# EasyEDA Pro project easyeda.eprj, board Dev_bl808
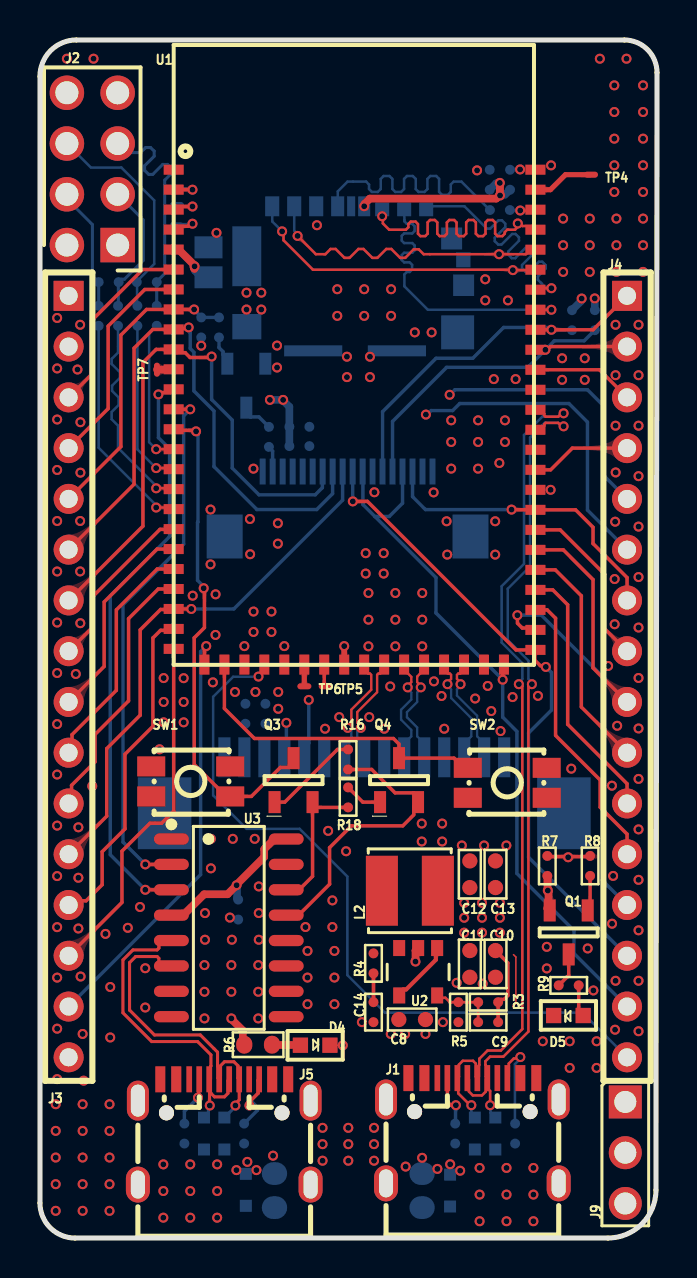
[diagram p2: board, top side]
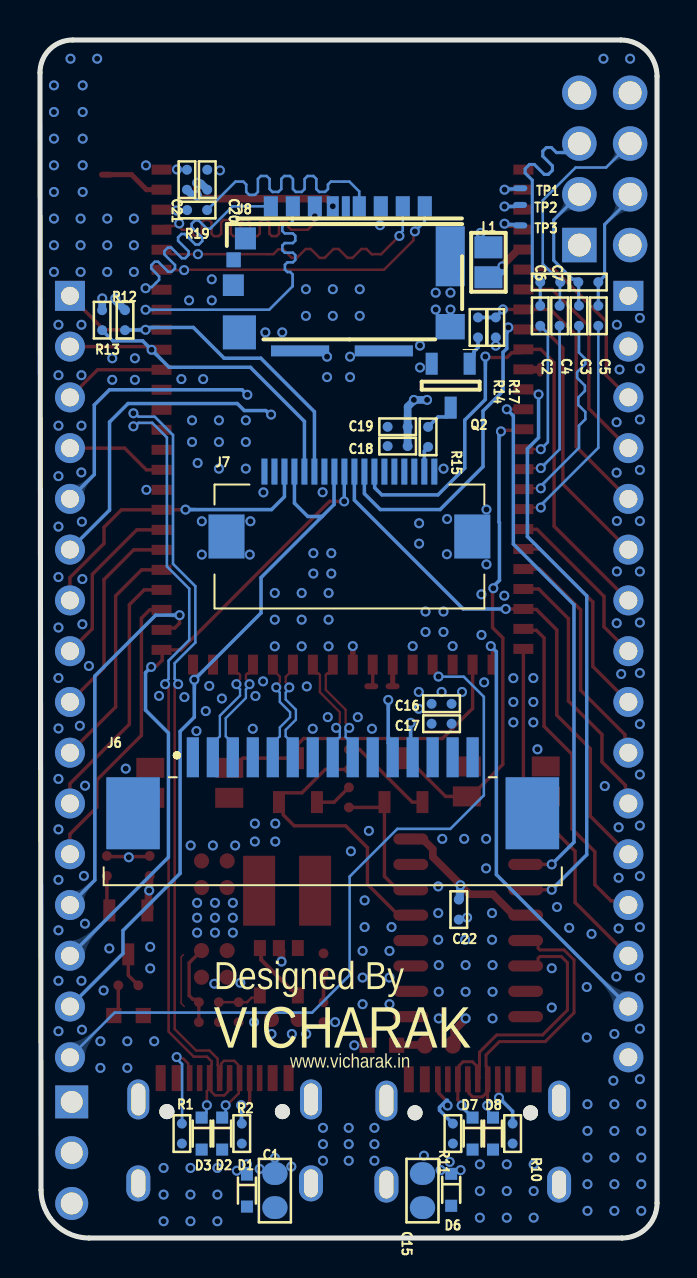
[diagram p3: board, bottom side, seen from below]

Outline 30.87 x 59.94 mm; copper layers: Top Layer, GND, PWR, Bottom Layer. Coordinates in mm from the lower left corner of the outline.
Outline path: 0,58.12 0,1.75 arc(0.51,0.51) 1.75,0 28.42,0 arc(30.12,0.7) 30.82,2.4 30.87,58.31 arc(30.4,59.47) 29.24,59.94 1.82,59.94 arc(0.53,59.41) 0,58.12
Stack: Top Layer 0.035mm / Dielectric 2 0.1mm PP-006 er 4.1 / GND 0.0175mm / Dielectric 1 1.265mm FR-4 er 4.8 / PWR 0.0175mm / Dielectric 5 0.1mm PP-006 er 4.1 / Bottom Layer 0.035mm

## Design rules (mm)
spacing safeClearance (default): track to track 0.152, other pairs 0.152 to 0.254
spacing BoardOutlineClearance: track to track 0.152, other pairs 0.152 to 0.254
spacing Clearance: track to track 0.152, other pairs 0.152 to 0.254
track width Width (default): min 0.051, default 0.172, max 0.381
differential pair DiffPairsRouting_1 (default): width min 0.116, default 0.127, max 0.152; gap min 0.127, default 0.178
differential pair DiffPairsRouting: width min 0.116, default 0.116, max 0.116; gap min 0.127, default 0.127
via RoutingVias (default): diameter min 0.5, default 0.5, max 0.5; hole min 0.3, default 0.3, max 0.3

## Placement (name value [footprint] x y rotation side)
C1  22uF  [capc0805]  19.12 2.37 90 bottom
C2  100nF  [capc0402]  5.84 46.14 270 bottom
C3  100nF  [CAPC0402]  3.91 46.14 270 bottom
C4  100nF  [CAPC0402]  4.88 46.14 270 bottom
C5  100nF  [capc0402]  2.94 46.14 270 bottom
C6  *  [CAPC0402]  5.34 47.83 180 bottom
C7  *  [CAPC0402]  3.44 47.83 180 bottom
C8  22uF  [capc0603]  18.62 10.93 0 top
C9  22pF  [capc0402]  22.42 10.8 0 top
C10  22uF  [capc0603]  22.79 13.72 270 top
C11  22uF  [capc0603]  21.51 13.72 270 top
C12  22uF  [capc0603]  21.51 18.2 90 top
C13  22uF  [capc0603]  22.79 18.2 90 top
C14  *  [capc0402]  16.69 11.3 270 top
C15  22uF  [capc0805]  11.73 2.37 90 bottom
C16  22uF  [CAPC0402]  10.78 26.73 180 bottom
C17  22uF  [CAPC0402]  10.78 25.73 180 bottom
C18  10uF  [CAPC0402]  12.98 39.62 0 bottom
C19  10uF  [CAPC0402]  12.98 40.59 0 bottom
C20  0402  [CAPC0402]  22.5 52.95 90 bottom
C21  0402  [CAPC0402]  23.52 52.95 90 bottom
C22  100nF  [CAPC0402]  9.92 16.43 90 bottom
D1  PESD5V0S1BBN  [sod523]  20.52 2.37 270 bottom
D2  LESD5Z5.0CT1G  [sod523]  21.76 5.23 270 bottom
D3  LESD5Z5.0CT1G  [sod523]  22.78 5.23 270 bottom
D4  LED  [led_0603]  13.77 9.65 0 top
D5  LED1  [led_0603]  26.44 11.13 180 top
D6  PESD5V0S1BBN  [sod523]  10.3 2.41 270 bottom
D7  LESD5Z5.0CT1G  [sod523]  9.23 5.23 270 bottom
D8  LESD5Z5.0CT1G  [sod523]  8.21 5.23 270 bottom
J1  C167321  [TYPE-C_usb]  21.63 5.37 0 top
J2  Header 4X2  [Header 2X4]  5.03 48.41 90 top
J3  header 16pin  [HEADER 16 PIN 2.54]  1.44 28.09 270 top
J4  header 16pin  [HEADER 16 PIN 2.54]  29.38 28.09 270 top
J5  C167321  [TYPE-C_usb]  9.22 5.31 0 top
J6  MIPI  [15pin FPC conn hoirzontal]  16.23 20.4 180 bottom
J7  18 PIN FPC connector  [18 pin fpc]  15.39 34.92 0 bottom
J8  SD Card Socket  [SD card socket_MIX]  15.77 48.01 0 bottom
J9  Header 3 pin  [3 pin header]  29.29 4.27 270 top
L1  Ferrite Bead  [C0805]  8.44 48.82 270 bottom
L2  2.2uH  [IND_4.0X4.0X2.0]  18.51 17.38 0 top
Q1  C148354  [SOT-23]  26.46 15.29 270 top
Q2  Transistor NPN  [SOT95P240X115-3N]  10.32 42.65 270 bottom
Q3  SS8050-G  [SOT23-3]  12.69 22.94 0 top
Q4  SS8050-G  [SOT23-3]  17.97 22.94 0 top
R1  5.1K  [resc0402]  23.77 5.23 270 bottom
R2  5.1K  [resc0402]  20.78 5.23 270 bottom
R3  215K  [resc0402]  22.43 11.8 0 top
R4  *  [resc0402]  16.69 13.74 90 top
R5  47.5K  [resc0402]  20.94 11.3 90 top
R6  2k  [RESC0603]  10.92 9.67 180 top
R7  10K  [resc0402]  25.39 18.62 90 top
R8  100E  [resc0402]  27.53 18.62 270 top
R9  5.1K  [resc0402]  26.46 12.64 180 top
R10  5.1K  [resc0402]  7.23 5.23 270 bottom
R11  5.1K  [resc0402]  10.22 5.23 270 bottom
R12  5.1K  [resc0402]  26.62 45.92 270 bottom
R13  10K  [resc0402]  27.76 45.92 270 bottom
R14  100E  [resc0402]  8.96 45.56 270 bottom
R15  5.1E  [resc0402]  11.46 40.09 270 bottom
R16  10K  [resc0402]  15.42 23.94 90 top
R17  10K  [resc0402]  8.07 45.56 270 bottom
R18  10K  [resc0402]  15.42 22.05 90 top
R19  22E  [resc0402]  23.01 51.44 180 bottom
SW1  Switch  [Micro Push Button 4 PAD]  7.54 22.85 180 top
SW2  Switch  [Micro Push Button 4 PAD]  23.38 22.78 0 top
TP1  Test_Point  [TESTPOINT SMD]  6.84 52.53 0 bottom
TP2  Test_Point  [TESTPOINT SMD]  6.85 51.69 0 bottom
TP3  Test_Point  [TESTPOINT SMD]  6.84 50.67 0 bottom
TP4  Test_Point  [TESTPOINT SMD]  27.57 53.2 180 top
TP5  Test_Point  [TESTPOINT SMD]  14.3 27.61 180 top
TP6  Test_Point  [TESTPOINT SMD]  13.23 27.61 180 top
TP7  Test_Point  [TESTPOINT SMD]  5.85 43.45 270 top
U1  BL-808  [BL808 MODULE]  8.23 28.69 0 top
U2  AP3429AKTTR-G1  [SOT23-5]  18.85 13.26 270 top
U3  *  [ch340c]  9.45 15.52 270 top

## Footprints (pads in the part's own frame, mm; a bottom-side part is the same pattern mirrored in y, then rotated)
3 pin header
  rect 1.65x1.65 hole 1.1: 1(-2.54,0)
  round 1.65 hole 1.1: 2(0,0) 3(2.54,0)
15pin FPC conn hoirzontal
  rect 0.61x2 smd: 1(-7,3.65) 2(-6,3.65) 3(-5,3.65) 4(-4,3.65) 5(-3,3.65) 6(-2,3.65) 7(-1,3.65) 8(0,3.65) 9(1,3.65) 10(2,3.65) 11(3,3.65) 12(4,3.65) 13(5,3.65) 14(6,3.65) 15(7,3.65)
  rect 2.68x3.6 smd: MP1(-9.99,0.85) MP2(9.99,0.85)
18 pin fpc
  rect 0.3x1.3 smd: 1(-4.25,-3.425) 2(-3.75,-3.425) 3(-3.25,-3.425) 4(-2.75,-3.425) 5(-2.25,-3.425) 6(-1.75,-3.425) 7(-1.25,-3.425) 8(-0.75,-3.425) 9(-0.25,-3.425) 10(0.25,-3.425) 11(0.75,-3.425) 12(1.25,-3.425) 13(1.75,-3.425) 14(2.25,-3.425) 15(2.75,-3.425) 16(3.25,-3.425) 17(3.75,-3.425) 18(4.25,-3.425)
  rect 1.8x2.2 smd: MP1(-6.15,-0.175) MP2(6.15,-0.175)
BL808 MODULE
  rect 1x0.5 smd: 1(-1.54,24.765) 2(-1.54,23.766) 3(-1.54,22.767) 4(-1.54,21.768) 5(-1.54,20.768) 6(-1.54,19.77) 7(-1.54,18.77) 8(-1.54,17.771) 9(-1.54,16.773) 10(-1.54,15.774) 11(-1.54,14.774) 12(-1.54,13.775) 13(-1.54,12.776) 14(-1.54,11.777) 15(-1.54,10.778) 16(-1.54,9.779) 17(-1.54,8.78) 18(-1.54,7.781) 19(-1.54,6.782) 20(-1.54,5.782) 21(-1.54,4.784) 22(-1.54,3.784) 23(-1.54,2.785) 24(-1.54,1.786) 25(-1.54,0.787) 42(16.561,0.737) 43(16.561,1.738) 44(16.561,2.739) 45(16.561,3.74) 46(16.561,4.742) 47(16.561,5.742) 48(16.561,6.744) 49(16.561,7.745) 50(16.561,8.746) 51(16.561,9.747) 52(16.561,10.748) 53(16.561,11.749) 54(16.561,12.751) 55(16.561,13.752) 56(16.561,14.753) 57(16.561,15.755) 58(16.561,16.756) 59(16.561,17.756) 60(16.561,18.758) 61(16.561,19.759) 62(16.561,20.76) 63(16.561,21.762) 64(16.561,22.762) 65(16.561,23.764) 66(16.561,24.765)
  rect 0.5x1 smd: 26(0,0) 27(0.999,0) 28(1.998,0) 29(2.997,0) 30(3.997,0) 31(4.995,0) 32(5.995,0) 33(6.994,0) 34(7.992,0) 35(8.992,0) 36(9.991,0) 37(10.989,0) 38(11.989,0) 39(12.988,0) 40(13.987,0) 41(14.986,0)
C0805
  rect 1.1x1.4 smd: 1(-0.75,0) 2(0.75,0)
capc0402
  rrect 0.5x0.5 smd: 1(-0.5,0) 2(0.5,0)
CAPC0402
  rrect 0.5x0.5 smd: 1(-0.5,0) 2(0.5,0)
capc0603
  rrect 0.762x0.762 smd: 1(-0.667,0) 2(0.667,0)
capc0805
  rrect 1.14x1.27 smd: 1(-0.852,0) 2(0.852,0)
ch340c
  oval 0.56x1.745 smd: 1(-4.445,-2.873) 2(-3.175,-2.873) 3(-1.905,-2.873) 4(-0.635,-2.873) 5(0.635,-2.873) 6(1.905,-2.873) 7(3.175,-2.873) 8(4.445,-2.873) 9(4.445,2.873) 10(3.175,2.873) 11(1.905,2.873) 12(0.635,2.873) 13(-0.635,2.873) 14(-1.905,2.873) 15(-3.175,2.873) 16(-4.445,2.873)
Header 2X4
  rect 1.725x1.725 hole 1.15: 1(1.27,1.145)
  round 1.725 hole 1.15: 2(3.81,1.145) 3(6.35,1.145) 4(8.89,1.145) 5(1.27,3.685) 6(3.81,3.685) 7(6.35,3.685) 8(8.89,3.685)
HEADER 16 PIN 2.54
  rect 1.5x1.5 hole 0.9: 1(-19.05,0)
  round 1.5 hole 0.9: 2(-16.51,0) 3(-13.97,0) 4(-11.43,0) 5(-8.89,0) 6(-6.35,0) 7(-3.81,0) 8(-1.27,0) 9(1.27,0) 10(3.81,0) 11(6.35,0) 12(8.89,0) 13(11.43,0) 14(13.97,0) 15(16.51,0) 16(19.05,0)
IND_4.0X4.0X2.0
  rect 1.6x3.5 smd: 1(-1.4,0) 2(1.4,0)
led_0603
  rect 0.762x0.762 smd: A(-0.737,0) K(0.737,0)
Micro Push Button 4 PAD
  rect 1.4x1 smd: 1(-1.975,0.75) 2(1.975,0.75) 3(-1.975,-0.75) 4(1.975,-0.75)
resc0402
  rrect 0.5x0.5 smd: 1(-0.5,0) 2(0.5,0)
RESC0603
  rrect 0.81x0.9 smd: 1(-0.695,0) 2(0.695,0)
SD card socket_MIX
  rect 0.703x1 smd: 1(3.549,-3.618) 2(2.449,-3.618) 3(1.349,-3.618) 6(-1.951,-3.618) 7(-3.051,-3.618) 8(-4.151,-3.618)
  rect 0.597x1 smd: 4(0.45,-3.618)
  rect 0.653x1 smd: 5(-0.876,-3.618)
  rect 0.4x1 smd: 9(-0.203,-3.618)
  rect 0.72x0.75 smd: 9(5.411,-0.938)
  rect 1.453x3 smd: 10(-5.426,-1.117)
  rect 1.455x1.27 smd: 10(-5.425,2.408)
  rect 2.91x0.55 smd: 10(-2.103,3.618) 10(2.087,3.618)
  rect 1.05x1.1 smd: 10(4.822,-2.007)
  rect 1.653x1.7 smd: 10(5.125,2.692)
  rect 1.05x1.08 smd: 10(5.426,0.333)
sod523
  rect 0.6x0.6 smd: A(0.8,0) K(-0.8,0)
SOT23-3
  rect 0.6x1.1 smd: 1(-0.95,-1.125) 2(0.95,-1.125) 3(0,1.075)
SOT23-5
  rect 0.8x0.6 smd: 1(-1.25,1.026) 2(-1.25,0.076) 3(-1.25,-0.874) 4(1.123,-0.873) 5(1.123,1.028)
SOT95P240X115-3N
  rect 1.1x0.6 smd: 1(-1.1,0.95) 2(-1.1,-0.95) 3(1.1,0)
SOT-23
  rect 1.1x0.6 smd: 1(-1.1,0.95) 2(-1.1,-0.95) 3(1.1,0)
TESTPOINT SMD
  rrect 0.7x0.3 smd: 1(0,0)
TYPE-C_usb
  round 0.75 hole 0.75: 1(-2.89,0.956) 2(2.89,0.956)
  rect 0.5x1.3 smd: A1(-3.2,2.633) A4(-2.4,2.633) A9(2.4,2.633) A12(3.2,2.633)
  rect 0.28x1.3 smd: A5(-1.25,2.633) A6(-0.25,2.633) A7(0.25,2.633) A8(1.25,2.634) B5(1.75,2.633) B6(0.75,2.633) B7(-0.75,2.633) B8(-1.75,2.634)
  oval 1.1x2 hole 0.7x1.6: S1(-4.32,1.565) S4(4.32,1.566)
  oval 1.2x1.8 hole 0.7x1.4: S2(-4.32,-2.634) S3(4.32,-2.634)

## Nets
3V3: C9.2 C10.1 C11.1 C12.1 C13.1 C16.2 C17.2 C18.1 C19.1 C20.1 C21.1 C22.2 J3.2 J6.14 J6.15 J7.3 J7.4 J8.4 J9.1 L1.2 L2.2 Q1.2 R3.2 R6.2 R7.1 R12.1 R13.1 U1.5 U3.4 U3.16
5V0: C1.2 C8.1 C15.2 D1.K D6.K J1.A4 J1.A9 J3.16 J5.A4 J5.A9 J9.2 U2.1 U2.4
GND: C1.1 C8.2 C10.2 C11.2 C12.2 C13.2 C14.2 C15.1 C16.1 C17.1 C18.2 C19.2 C20.2 C21.2 C22.1 D1.A D2.A D3.A D4.K D5.K D6.A D7.A D8.A J1.A1 J1.A12 J1.S1 J1.S2 J1.S3 J1.S4 J2.5 J2.8 J3.1 J5.A1 J5.A12 J5.S1 J5.S2 J5.S3 J5.S4 J6.1 J6.4 J6.7 J6.10 J6.13 J6.MP1 J6.MP2 J7.1 J7.5 J7.6 J7.12 J7.18 J7.MP1 J7.MP2 J8.6 J8.10 J9.3 Q2.2 R1.2 R2.2 R5.1 R10.2 R11.2 R17.2 SW1.4 SW2.4 U1.1 U1.28 U1.30 U1.33 U1.40 U1.50 U1.52 U1.55 U1.66 U2.2 U3.1
CSI0_N: J6.3 U1.38
CSI0_P: J6.2 U1.39
CSI1_N: J6.9 U1.34
CSI1_P: J6.8 U1.35
CSICLK_N: J6.6 U1.36
CSICLK_P: J6.5 U1.37
D_N: D7.K J5.A6 J5.B6 U3.6
D_P: D8.K J5.A7 J5.B7 U3.5
DTR: Q4.2 R16.1 U3.13
GPIO_8: J4.3 R7.2 R8.1 U1.56
GPIO_39: Q4.3 SW2.1 U1.27
M1_N: C3.1 C7.1 J2.2
M1_P: C5.1 C7.2 J2.6
M2_N: C2.1 C6.1 J2.3
M2_P: C4.1 C6.2 J2.7
MIC1_N: C3.2 U1.17
MIC1_P: C5.2 U1.18
MIC2_N: C2.2 U1.15
MIC2_P: C4.2 U1.16
NETC9_1: C9.1 R3.1 R5.2 U2.5
NETC14_1: C14.1 R4.1
NETD4_A: D4.A R6.1
NETD5_A: D5.A R9.1
NETJ1_A5: J1.A5 R2.1
NETJ1_B5: J1.B5 R1.1
NETJ2_1: J2.1 J2.4 L1.1
NETJ3_3: J3.3 U1.6
NETJ3_4: J3.4 U1.7
NETJ3_5: J3.5 R14.1 R17.1 U1.8
NETJ3_6: J3.6 J7.8 U1.9
NETJ3_7: J3.7 J7.7 U1.10
NETJ3_8: J3.8 U1.19
NETJ3_9: J3.9 U1.20
NETJ3_10: J3.10 U1.21
NETJ3_11: J3.11 U1.22
NETJ3_12: J3.12 J7.9 U1.23
NETJ3_13: J3.13 U1.24
NETJ3_14: J3.14 U1.25
NETJ3_15: J3.15 U1.26
NETJ4_1: J4.1 J6.11 J7.13 R12.2 U1.58
NETJ4_2: J4.2 J6.12 J7.14 R13.2 U1.57
NETJ4_4: J4.4 U1.51
NETJ4_7: J4.7 J7.16 U1.49
NETJ4_8: J4.8 U1.48
NETJ4_9: J4.9 U1.47
NETJ4_10: J4.10 U1.46
NETJ4_11: J4.11 U1.45
NETJ4_12: J4.12 U1.44
NETJ4_13: J4.13 U1.43
NETJ4_14: J4.14 J7.10 U1.42
NETJ4_15: J4.15 J7.11 J7.15 U1.41
NETJ4_16: J4.16 U1.29
NETJ5_A5: J5.A5 R10.1
NETJ5_B5: J5.B5 R11.1
NETJ7_2: J7.2 R15.2
NETJ8_1: J8.1 U1.60
NETJ8_2: J8.2 U1.59
NETJ8_3: J8.3 U1.63
NETJ8_5: J8.5 R19.2
NETJ8_7: J8.7 U1.62
NETJ8_8: J8.8 U1.61
NETL2_1: L2.1 R4.2 U2.3
NETQ1_1: Q1.1 R8.2
NETQ1_3: Q1.3 R9.2
NETQ2_1: Q2.1 R14.2
NETQ2_3: Q2.3 R15.1
NETQ3_1: Q3.1 R16.2
NETQ4_1: Q4.1 R18.2
NETR19_1: R19.1 U1.64
NETTP1_1: TP1.1 U1.2
NETTP2_1: TP2.1 U1.3
NETTP3_1: TP3.1 U1.4
NETTP4_1: TP4.1 U1.65
NETTP5_1: TP5.1 U1.32
NETTP6_1: TP6.1 U1.31
NETTP7_1: TP7.1 U1.11
PU_CHIP: Q3.3 SW1.1 U1.14
RTS: Q3.2 R18.1 U3.14
U0RXD: J4.6 U1.13 U3.2
U0TXD: J4.5 U1.12 U3.3
USB_N: D2.K J1.A7 J1.B7 U1.54
USB_P: D3.K J1.A6 J1.B6 U1.53

Pads without a net: J1 1 2 A8 B8; J5 1 2 A8 B8; J7 17; J8 9; SW1 2 3; SW2 2 3; U3 7 8 9 10 11 12 15

## Via types
v1: diameter 0.5, hole 0.3, Top Layer to Bottom Layer, 383 vias

## Routing (per net, layer and track width the routed paths; a pad name or vN(x,y) marks a point on that pad's centre or on a via; arc(x,y) is an arc through that point)
3V3: length 32
  Top Layer w0.17: C10.1 23.41,13.76 23.41,12.13 23.22,11.94 23.07,11.94 R3.2 22.92,10.8
  Top Layer w0.178: 25.39,17.31 25.39,17.39
  Top Layer w0.381: R7.1 25.4,18.11 25.4,17.4 v1(25.41,17.39) 25.45,17.35 25.45,16.49 25.39,16.49 25.39,16.51 ; 7.73,48.49 7.71,48.51 7.71,48.69 6.94,49.46 U1.5 ; v1(16.22,51.62) 16.25,51.65 16.25,51.75 16.51,52.01 22.83,52.01 22.99,52.16 23.01,52.16 v1(23.01,52.79) 23.01,52.79 23.01,52.17 v1(23.02,52.16) ; R6.2 10.15,9.74 10.15,10.38 9.58,10.96 v1(9.58,10.99) ; U3.4 6.63,16.21 7.23,16.21 8.22,17.2 9.38,17.2 v1(9.84,17.65) 9.84,17.69 11.22,19.07 11.22,19.46 11.67,19.91 12.26,19.91 U3.16
  Bottom Layer w0.381: C22.2 9.86,16.99 9.86,17.63 v1(9.84,17.65) ; 8.16,47.99 7.76,48.4 7.76,48.59 v1(7.74,48.62) ; C18.1 C19.1 12.48,41.59 12.17,41.9 v1(12.17,41.94) v1(11.51,41.94) ; v1(27.1,47.01) 27.1,46.97 27.06,46.94 27.06,46.87 R12.1 ; v1(27.76,47.01) 27.76,47.01 27.76,46.43 R13.1 ; C20.1 22.82,52.77 22.98,52.77 v1(23.01,52.79) ; 23.26,52.19 C21.1
  vias: v1(9.76,27.32) v1(10.78,27.32) v1(21.22,16.77) v1(21.22,16.03) v1(21.22,15.28) v1(22.12,16.77) v1(22.12,16.03) v1(22.12,15.28) v1(23.01,16.77) v1(23.01,16.03) v1(23.01,15.28)
5V0: length 31.8
  Top Layer w0.203: 17.97,12.13 17.97,12.14 17.97,12.24 18.17,12.43 18.32,12.43 19.81,13.92 19.81,14.45 19.87,14.51 ; C8.1 17.97,10.94
  PWR w0.381: v1(15.43,5.51) 15.43,6.99 13.37,9.04 J3.16 ; v1(16.72,4.7) 27.54,4.7 28.11,4.12 28.7,4.12 28.7,4.12
  vias: v1(9.83,3.4) v1(10.38,3.81) v1(10.83,3.4) v1(11.66,4.12) v1(14.14,5.51) v1(14.14,4.7) v1(14.14,3.87) v1(15.43,4.7) v1(15.43,3.87) v1(16.72,5.51) v1(16.72,3.87) v1(17.55,10.21) v1(18.27,10.21) v1(18.3,3.57) v1(19.12,4.01) v1(19.88,3.46) v1(20.53,3.69) v1(21.03,3.37)
GND: length 5
  Top Layer w0.076: 23.69,14.18 23.81,14.06 23.81,11.74 23.66,11.59 ; v1(15.15,9.64) 14.51,9.64 D4.K
  Top Layer w0.28: U1.33 v1(15.22,29.62)
  Top Layer w0.381: U2.2 18.79,14.38 v1(18.79,13.83)
  vias: v1(0.79,6.69) v1(0.79,5.36) v1(0.79,4.03) v1(0.79,2.69) v1(0.79,1.36) v1(0.86,46.03) v1(0.86,43.51) v1(0.86,40.95) v1(0.86,38.43) v1(0.86,35.88) v1(0.86,33.35) v1(0.86,30.8) v1(0.86,28.27) v1(0.86,25.72) v1(0.86,23.19) v1(0.86,20.64) v1(0.86,18.11) v1(0.86,15.56) v1(0.86,13.03) v1(0.86,10.47) v1(0.86,7.95) v1(1.35,59.01) v1(1.79,28.22) v1(1.88,43.45) v1(1.92,20.55) v1(1.92,18.03) v1(1.92,15.49) v1(2.01,45.69) v1(2.02,40.82) v1(2.02,38.3) v1(2.01,35.88) v1(2.01,33.35) v1(2.02,30.76) v1(2.03,13.08) v1(2.13,10.21) v1(2.19,7.87) v1(2.13,6.69) v1(2.13,5.36) v1(2.13,4.03) v1(2.13,2.69) v1(2.13,1.36) v1(2.68,59.01) v1(2.61,22.61) v1(3.28,15.22) v1(3.48,6.69) v1(3.48,5.36) v1(3.48,4.03) v1(3.48,2.69) v1(3.48,1.36) v1(3.52,12.56) v1(3.52,10.03) v1(4.4,15.52) v1(5,16.56) v1(5.27,13.5) v1(5.27,11.53) v1(5.98,24.45) v1(6.19,28.02) v1(6.19,26.82) v1(6.19,25.8) v1(6.17,3.69) v1(6.17,2.35) v1(6.17,1.02) v1(7.19,28.01) v1(7.19,26.82) v1(7.19,25.8) v1(7.52,3.69) v1(7.52,2.35) v1(7.52,1.02) v1(7.64,32.14) v1(8.07,44.65) v1(8.26,16.26) v1(8.26,14.92) v1(8.23,13.66) v1(8.23,12.32) v1(8.23,10.99) v1(8.53,36.45) v1(8.53,33.71) v1(8.55,19.97) v1(8.55,18.5) v1(8.65,27.8) v1(8.79,32.21) v1(8.78,30.17) v1(8.87,3.69) v1(8.87,2.35) v1(8.87,1.02) v1(9.5,16.03) v1(9.58,13.66) v1(9.58,12.32) v1(9.65,19.97) v1(9.6,14.92) v1(10.23,29.62) v1(10.34,47.3) v1(10.34,46.46) v1(10.51,35.98) v1(10.52,34.21) v1(10.68,38.5) v1(10.69,31.35) v1(10.69,30.33) v1(10.75,19.97) v1(10.95,17.59) v1(10.95,16.26) v1(10.95,14.92) v1(10.92,13.66) v1(10.92,12.32) v1(10.92,10.99) v1(11.07,47.3) v1(11.07,46.46) v1(11.58,31.35) v1(11.58,30.33) v1(11.86,44.65) v1(11.86,43.56) v1(11.9,35.76) v1(11.9,34.74) v1(11.92,27.32) v1(11.92,26.48) v1(12.23,29.62) v1(13.29,15.56) v1(13.39,14.37) v1(13.39,13.03) v1(13.39,11.7) v1(13.86,50.68) v1(14.26,25.48) v1(14.42,20.37) v1(14.63,16.89) v1(14.63,15.56) v1(14.73,14.37) v1(14.73,13.03) v1(14.73,11.7) v1(14.88,47.47) v1(14.88,46.14) v1(14.97,26.06) v1(15.36,44.1) v1(15.36,43.08) v1(15.32,19.35) v1(16.11,10.8) v1(16.22,47.47) v1(16.22,46.14) v1(16.3,34.27) v1(16.3,33.25) v1(16.44,32.27) v1(16.44,30.94) v1(16.44,29.61) v1(16.48,26.06) v1(16.51,44.1) v1(16.51,43.08) v1(16.73,37.31) v1(17.2,34.27) v1(17.2,33.25) v1(17.23,25.48) v1(17.57,47.47) v1(17.57,46.14) v1(17.53,27.6) v1(17.78,32.27) v1(17.78,30.94) v1(17.78,29.61) v1(18.75,45.31) v1(19.13,32.27) v1(19.13,30.94) v1(19.13,29.61) v1(19.1,20.74) v1(19.1,19.84) v1(19.29,10.21) v1(19.6,45.31) v1(19.7,37.31) v1(19.71,27.85) v1(20.09,27.12) v1(20.12,20.74) v1(20.12,19.84) v1(20.16,10.8) v1(20.23,25.48) v1(20.35,35.86) v1(20.38,34.19) v1(20.58,40.91) v1(20.58,39.83) v1(20.58,38.5) v1(20.85,12.77) v1(21.11,19.64) v1(21.77,26.99) v1(21.87,53.42) v1(21.92,40.91) v1(21.92,39.83) v1(21.92,38.5) v1(22,3.51) v1(22,2.17) v1(22,0.84) v1(22.15,12.72) v1(22.28,47.97) v1(22.28,46.92) v1(22.22,19.64) v1(22.4,27.62) v1(22.58,26.36) v1(22.71,42.98) v1(22.78,35.86) v1(22.78,34.19) v1(22.99,38.78) v1(23.04,25.37) v1(23.27,40.91) v1(23.27,39.83) v1(23.34,19.64) v1(23.34,3.51) v1(23.34,2.17) v1(23.34,0.84) v1(23.41,46.92) v1(23.65,27.07) v1(23.8,42.98) v1(24.02,53.47) v1(24.69,3.51) v1(24.69,2.17) v1(24.69,0.84) v1(24.92,27.13) v1(25.16,9.85) v1(25.36,14.57) v1(25.36,13.49) v1(25.57,53.67) v1(25.55,37.44) v1(26.18,51.01) v1(26.18,49.67) v1(26.18,48.34) v1(26.12,44.02) v1(26.12,42.94) v1(26.58,23.48) v1(26.5,9.85) v1(26.5,8.51) v1(27.26,44.02) v1(27.26,42.94) v1(27.41,14.49) v1(27.51,51.01) v1(27.51,49.67) v1(27.51,48.34) v1(27.69,12.39) v1(27.85,9.85) v1(27.85,8.51) v1(28.01,59.01) v1(28.43,28.62) v1(28.62,22.63) v1(28.68,18.12) v1(28.62,15.73) v1(28.74,57.67) v1(28.74,56.34) v1(28.74,55.01) v1(28.74,53.67) v1(28.74,52.34) v1(28.78,35.84) v1(28.75,32.97) v1(28.75,30.71) v1(28.78,10.42) v1(28.84,51.01) v1(28.84,49.67) v1(28.84,48.34) v1(28.8,45.69) v1(28.8,43.17) v1(28.8,40.64) v1(28.81,38.31) v1(28.88,25.63) v1(28.8,12.87) v1(29.35,59.01) v1(29.95,45.69) v1(29.95,43.17) v1(29.95,40.64) v1(29.95,38.12) v1(29.95,35.6) v1(29.95,33.07) v1(29.95,30.55) v1(29.95,28.02) v1(29.95,25.5) v1(29.95,22.97) v1(29.95,20.45) v1(29.95,17.92) v1(29.95,15.4) v1(29.95,12.87) v1(29.95,10.35) v1(30.18,57.67) v1(30.18,56.34) v1(30.18,55.01) v1(30.18,53.67) v1(30.18,52.34) v1(30.18,51.01) v1(30.18,49.67) v1(30.18,48.34)
CSI0_N: length 5.5
  Top Layer w0.116: v1(20.39,27.71) 20.39,27.79 20.57,27.97 20.57,28.18 20.5,28.25 20.41,28.25 20.22,28.44 U1.38
  Bottom Layer w0.116: J6.3 21.23,24.75 21.58,25.1 21.58,26.01 20.57,27.02 20.57,27.45 20.39,27.63 v1(20.39,27.71)
CSI0_P: length 5.5
  Top Layer w0.116: U1.39 21.22,28.44 21.03,28.25 20.93,28.25 20.86,28.18 20.86,27.97 21.04,27.79 v1(21.04,27.71)
  Bottom Layer w0.116: v1(21.04,27.71) 21.04,27.63 20.86,27.45 20.86,27.14 21.87,26.13 21.87,25.1 22.23,24.75 J6.2
CSI1_N: length 5.6
  Top Layer w0.116: U1.34 16.22,28.44 16.41,28.25 16.51,28.25 16.57,28.18 16.57,27.43 15.58,26.44 15.58,25.79 15.4,25.61 v1(15.4,25.53)
  Bottom Layer w0.116: v1(15.4,25.53) 15.48,25.53 15.58,25.42 15.58,25.06 15.51,25 15.47,25 15.23,24.75 J6.9
CSI1_P: length 5.6
  Top Layer w0.116: U1.35 17.22,28.44 17.03,28.25 16.94,28.25 16.87,28.18 16.87,27.31 15.87,26.31 15.87,25.79 16.05,25.61 v1(16.05,25.53)
  Bottom Layer w0.116: v1(16.05,25.53) 15.98,25.53 15.87,25.42 15.87,25.06 15.94,25 15.98,25 16.23,24.75 J6.8
CSICLK_N: length 5.5
  Top Layer w0.116: v1(18.4,27.55) 18.4,27.63 18.58,27.81 18.58,28.08 18.22,28.44 U1.36
  Bottom Layer w0.116: J6.6 18.23,24.75 18.58,25.1 18.58,25.42 18.07,25.94 18.07,26.43 18.58,26.95 18.58,27.29 18.4,27.47 v1(18.4,27.55)
CSICLK_P: length 5.5
  Top Layer w0.116: v1(19.05,27.55) 19.05,27.63 18.87,27.81 18.87,28.09 19.22,28.44 U1.37
  Bottom Layer w0.116: J6.5 19.23,24.75 18.87,25.1 18.87,25.55 18.36,26.06 18.36,26.31 18.87,26.82 18.87,27.29 19.05,27.47 v1(19.05,27.55)
D_N: length 16.1
  Top Layer w0.152: U3.6 6.14,13.61 5.95,13.8 5.95,14 5.86,14.08 4.79,14.08 4.48,13.78 4.48,11.4 5.73,10.16 8.02,10.16 8.7,9.48 8.88,9.3 8.88,8.6 8.91,8.58 8.91,8.01 9.03,8.13 9.03,8.62 9.24,8.82 9.7,8.82 9.91,8.62 9.91,8.01 9.97,7.94 9.97,6.91 9.78,6.72 v1(9.78,6.63)
  Bottom Layer w0.152: v1(9.78,6.63) 9.78,6.58 D7.K
D_P: length 15.9
  Top Layer w0.152: 9.47,7.94 9.41,7.88 9.41,7.24 9.23,7.06 8.74,7.06 8.56,7.24 8.48,7.24 ; 8.53,7.94 8.53,8.58 8.56,8.6 8.56,9.16 7.89,9.83 5.59,9.83 4.15,11.27 4.15,13.92 4.65,14.41 5.86,14.41 5.95,14.5 5.95,14.7 6.14,14.88 U3.5 ; v1(8.5,6.63) 8.48,6.64 8.48,7.24 ; 8.48,7.24 8.48,7.93 8.47,7.94
  Bottom Layer w0.152: v1(8.5,6.63) 8.43,6.56 8.43,6.25 D8.K
DTR: length 14.6
  Top Layer w0.172: R16.1 16.6,23.44 17.77,22.27 18.7,22.27 18.92,22.06 Q4.2 18.7,21.6 18.7,21.17 18.15,20.62 15.58,20.62 14.49,19.53 14.49,17.7 12.94,16.15 U3.13
GPIO_8: length 31.9
  Top Layer w0.172: 26.51,19.12 26.54,19.08 27.49,19.08 R8.1 ; R7.2 25.42,19.08 26.4,19.08 v1(26.43,19.05) ; J4.3 28,43.44 U1.56
  PWR w0.172: J4.3 27.91,40.6 27.91,19.81 27.15,19.05 v1(26.43,19.05)
GPIO_39: length 16
  Top Layer w0.172: U1.27 9.23,26.5 10.73,24.99 17.68,24.99 17.96,24.72 17.96,24.02 Q4.3 20.72,24.01 21.21,23.53 SW2.1
M1_N: length 6.7
  Bottom Layer w0.152: C3.1 3.92,46.66 3.92,47.81 4.08,47.97 4.23,47.97 5.17,48.92 5.17,50.94 J2.2
M1_P: length 6.2
  Bottom Layer w0.152: 2.94,46.64 C7.2 2.62,48.14 2.62,50.71 1.35,51.98 J2.6
M2_N: length 12.3
  Bottom Layer w0.152: C2.1 C6.1 5.84,47.86 6.24,48.25 6.24,52.93 6.6,53.29 6.6,53.5 6.38,53.72 6.14,53.72 5.64,53.22 5.44,53.22 5.23,53.42 5.23,53.65 5.72,54.13 5.72,54.38 5.54,54.56 5.29,54.56 5.03,54.31 4.53,54.31 4.08,54.76 J2.3
M2_P: length 11.2
  Bottom Layer w0.127: J2.7 2.55,53.56 4.07,53.56 5.72,51.92 5.72,48.74 4.84,47.86 C6.2 4.86,47.81 4.86,46.66 C4.1
MIC1_N: length 10.6
  Top Layer w0.127: 5.93,37.51 6.65,37.51 U1.17
  Bottom Layer w0.127: C3.2 3.91,44.3 3.59,43.99 3.59,43.73 4,43.32 4,43.04 3.61,42.65 3.61,42.39 3.94,42.06 3.94,41.68 3.59,41.33 3.59,40.97 3.91,40.65 3.91,39.53 5.93,37.51
  vias: v1(5.81,37.51)
MIC1_P: length 11.1
  Top Layer w0.127: U1.18 6.61,36.55 5.93,36.55
  Bottom Layer w0.127: C5.2 2.94,39.54 5.93,36.55
  vias: v1(5.81,36.55)
MIC2_N: length 7.2
  Top Layer w0.127: 5.93,39.47 U1.15
  Bottom Layer w0.127: C2.2 5.46,45.26 5.46,39.82 v1(5.81,39.47)
MIC2_P: length 8.4
  Top Layer w0.127: U1.16 6.64,38.52 v1(5.81,38.52)
  Bottom Layer w0.127: v1(5.81,38.52) 4.88,39.46 C4.2
NETC9_1: length 3.2
  Top Layer w0.127: 19.87,12.14 19.99,12.02 20.29,12.02 20.51,11.8 R5.2 R3.1 21.92,10.8
NETC14_1: length 1.4
  Top Layer w0.178: C14.1 R4.1
NETD4_A: length 1.4
  Top Layer w0.381: D4.A 13.02,9.66 11.62,9.66 R6.1
NETD5_A: length 1.6
  Top Layer w0.172: D5.A 26.96,11.36 R9.1
NETJ1_A5: length 2.4
  Top Layer w0.172: v1(20.81,6.65) 20.56,6.65 20.38,6.82 J1.A5
  Bottom Layer w0.172: R2.1 20.79,5.74 20.79,6.37 20.81,6.39
NETJ1_B5: length 5
  Top Layer w0.127: v1(24.03,9.05) 23.96,8.98 23.71,8.98 23.46,8.73 23.46,8.08 J1.B5
  Bottom Layer w0.127: v1(24.03,9.05) 24.03,8.97 23.76,8.7 23.76,5.67
NETJ2_1: length 15.3
  PWR w0.381: v1(8.83,50.29) 8.22,49.68 J2.1 5.78,51.57 5.78,55.41 J2.4
  Bottom Layer w0.381: L1.1 8.47,49.57 8.83,49.93 v1(8.83,50.29)
NETJ3_3: length 9.5
  Top Layer w0.172: U1.6 5.14,48.46 2.54,45.86 2.54,43.17 J3.3
NETJ3_4: length 11
  Top Layer w0.172: U1.7 5.25,47.46 3.41,45.63 3.41,41.5 J3.4
NETJ3_5: length 14.9
  Top Layer w0.172: J3.5 4.05,39.6 4.05,45.18 5.33,46.46 U1.8 v1(7.71,46.46)
  Bottom Layer w0.172: v1(7.71,46.46) 7.71,46.44 8.07,46.08 R17.1 R14.1
NETJ3_6: length 30.3
  Top Layer w0.172: v1(7.44,45.56) 7.39,45.51 6.74,45.51 6.69,45.46 5.65,45.46 4.71,44.52 4.71,37.72 J3.6
  Bottom Layer w0.172: J7.8 14.64,37.24 13.85,36.45 10.85,36.45 8.71,38.6 8.71,41.38 7.7,42.38 7.7,44.32 7.52,44.51 7.52,45.3 7.5,45.31 7.5,45.5 v1(7.44,45.56)
NETJ3_7: length 29.4
  Top Layer w0.172: J3.7 5.15,35.62 5.15,43.8 5.81,44.46 U1.10 6.85,44.3 7.27,44.3 7.51,44.06 8.54,44.06 v1(8.59,44.1)
  Bottom Layer w0.172: J7.7 14.13,38.34 14.13,37.54 13.77,37.19 10.96,37.19 9.62,38.52 9.62,40.92 8.59,41.96 v1(8.59,44.1)
NETJ3_8: length 8.7
  Top Layer w0.172: J3.8 2.65,30.58 2.65,32.11 6.01,35.46 6.68,35.46 U1.19
NETJ3_9: length 10.3
  Top Layer w0.172: U1.20 5.86,34.47 3.21,31.83 3.21,28.6 J3.9
NETJ3_10: length 11.8
  Top Layer w0.172: J3.10 1.61,24.45 1.61,25.19 3.82,27.41 3.82,31.43 5.87,33.47 U1.21
NETJ3_11: length 13.4
  Top Layer w0.172: U1.22 5.92,32.47 4.43,30.99 4.43,26.87 2.76,25.2 2.76,23.83 1.58,22.65 1.58,21.89 J3.11
NETJ3_12: length 27
  Top Layer w0.172: v1(7.57,31.47) U1.23 6.66,31.45 6.04,31.45 5.02,30.43 5.02,26.16 3.34,24.49 3.34,21.11 J3.12
  Bottom Layer w0.172: J7.9 15.14,36.92 9.7,31.47 v1(7.57,31.47)
NETJ3_13: length 16.7
  Top Layer w0.172: J3.13 1.65,16.87 2.31,16.87 3.11,17.68 3.11,19.33 4.25,20.47 4.25,24.21 5.65,25.6 5.65,30.03 6.03,30.41 6.62,30.41 U1.24
NETJ3_14: length 17.9
  Top Layer w0.172: J3.14 4.1,16.79 4.1,19.35 5.5,20.75 6.08,20.75 6.69,21.36 U1.25
NETJ3_15: length 21.8
  Top Layer w0.172: v1(8.32,29.62) 8.32,29.53 8.23,29.44 U1.26
  Bottom Layer w0.172: J3.15 8.04,18.19 8.04,29.34 v1(8.32,29.62)
NETJ4_1: length 48.7
  Top Layer w0.172: J4.1 27.68,45.44 v1(25.59,45.44) U1.58
  PWR w0.172: v1(13.45,26.92) 15.21,28.68 20.72,28.68 21.29,29.25 21.29,36.39 24.51,39.61 24.51,44.59 25.3,45.38 25.53,45.38 v1(25.59,45.44)
  Bottom Layer w0.172: v1(25.59,45.44) 25.6,45.43 26.61,45.43 R12.2 ; v1(13.45,26.92) 13.45,24.76 13.23,24.54 ; J7.13 17.14,41.34 19.82,44.02 21.66,44.02 23.2,45.56 25.39,45.56
NETJ4_2: length 48.8
  Top Layer w0.172: U1.57 v1(25.29,44.44) 25.38,44.44 25.54,44.6 J4.2
  PWR w0.172: v1(25.29,44.44) 25.29,38.66 24.49,37.86 24.49,30.4 20.64,26.55 14.41,26.55 13.64,25.78 v1(12.33,25.78)
  Bottom Layer w0.172: 20.34,43.56 17.64,40.86 J7.14 ; R13.2 27.23,44.89 25.74,44.89 v1(25.29,44.44) 24.41,43.57 20.33,43.57 ; 12.33,24.64 v1(12.33,25.78)
NETJ4_4: length 5
  Top Layer w0.172: J4.4 26.64,39.52 25.55,38.44 U1.51
NETJ4_7: length 15.3
  Top Layer w0.172: v1(23.59,36.45) 23.6,36.44 24.78,36.44 U1.49 26.8,36.43 27.67,35.56 27.67,34.75 29.38,33.04 J4.7
  Bottom Layer w0.172: v1(23.59,36.45) 19.29,36.45 18.64,37.09 J7.16
NETJ4_8: length 8.7
  Top Layer w0.172: U1.48 26.03,35.43 28.26,33.2 28.26,30.48 J4.8
NETJ4_9: length 10.3
  Top Layer w0.172: J4.9 27.67,28.52 27.67,32.94 26.19,34.43 U1.47
NETJ4_10: length 11.6
  Top Layer w0.172: U1.46 25.79,33.43 27.09,32.13 27.09,26.57 J4.10
NETJ4_11: length 13.1
  Top Layer w0.172: J4.11 29.38,22.73 26.4,25.7 26.4,31.68 25.66,32.43 U1.45
NETJ4_12: length 14.5
  Top Layer w0.172: J4.12 29.38,20.21 28.03,21.56 28.03,22.92 25.8,25.15 25.8,31.01 25.38,31.43 U1.44
NETJ4_13: length 18.9
  Top Layer w0.172: v1(23.89,31.16) 23.89,31.16 23.89,30.76 24.13,30.52 24.7,30.52 24.79,30.43
  Bottom Layer w0.172: J4.13 28.13,17.91 28.13,28.12 25.08,31.17 23.89,31.17 v1(23.89,31.16)
NETJ4_14: length 32
  Top Layer w0.172: v1(15.65,36.86) 16.39,36.86 23.82,29.43 U1.42 24.76,29.4 24.76,28.91 25.03,28.64 25.25,28.64 v1(25.31,28.58)
  Bottom Layer w0.172: v1(25.31,28.58) 25.59,28.29 25.59,26.42 24.45,25.27 24.45,19.05 J4.14 ; v1(15.65,36.86) 15.65,36.86 15.65,38.34 J7.10
NETJ4_15: length 36.3
  Top Layer w0.172: v1(23.15,27.94) 23.15,28.63 U1.41
  Bottom Layer w0.172: 16.76,36.1 17.47,36.1 18.14,36.77 J7.15 ; 16.76,36.1 19.81,33.05 19.81,31.27 v1(23.15,27.94) 23.15,26.06 23.86,25.35 23.86,18.24 26.72,15.38 26.72,14.24 J4.15 ; 16.76,36.1 16.16,36.7 16.16,38.33 J7.11
NETJ4_16: length 37.4
  Top Layer w0.172: U1.29 11.23,28.44 10.93,28.15 v1(10.93,28.09)
  Bottom Layer w0.127: v1(10.93,28.09) 10.92,28.08 9.67,28.08 8.67,27.08 8.67,22.15 10.34,20.47 12.99,20.47 15.38,18.08 15.38,13.16 17.26,11.28 27.14,11.28 J4.16
NETJ5_A5: length 2.5
  Top Layer w0.172: 7.97,7.94 7.94,7.91 7.94,7.05 v1(7.91,7.02)
  Bottom Layer w0.172: v1(7.91,7.02) 7.23,6.34 R10.1
NETJ5_B5: length 3.2
  Top Layer w0.172: 10.97,7.94 10.92,7.89 10.92,7.25 10.54,6.87 10.54,6.69 v1(10.48,6.63)
  Bottom Layer w0.172: R11.1 10.88,6.4 10.88,6.54 10.53,6.89 10.48,6.89
NETJ7_2: length 1.3
  Bottom Layer w0.172: J7.2 11.64,39.38 11.46,39.56 R15.2
NETJ8_1: length 15.2
  Top Layer w0.127: v1(25.59,47.52) 24.87,47.52 U1.60
  Bottom Layer w0.127: v1(25.59,47.52) 25.53,47.58 25.28,47.58 25.09,47.77 24.91,47.94 24.91,48.12 25.31,48.51 25.31,48.68 25.13,48.85 24.96,48.85 24.46,48.34 24.29,48.34 24.12,48.51 24.12,48.69 24.65,49.21 24.65,49.38 24.48,49.55 24.31,49.55 23.78,49.03 23.61,49.03 23.44,49.2 23.44,49.37 23.97,49.9 23.97,50.07 23.79,50.24 23.62,50.24 23.1,49.71 22.92,49.71 22.75,49.88 22.75,50.05 23.28,50.58 23.28,50.75 23.11,50.92 22.94,50.92 22.53,50.5 22.36,50.5 22.31,50.55 21.24,51.62 J8.1
NETJ8_2: length 15.2
  Top Layer w0.127: U1.59 v1(25.59,46.45)
  Bottom Layer w0.127: v1(25.59,46.45) 19.41,46.45 18.23,47.62 18.23,48.21 18.35,48.33 18.5,48.33 18.62,48.45 18.62,48.7 18.5,48.82 18.22,48.82 18.1,48.94 18.1,49.18 18.22,49.3 18.63,49.3 18.75,49.42 18.75,49.66 18.63,49.78 18.22,49.78 18.1,49.9 18.1,50.14 18.22,50.27 18.63,50.27 18.75,50.39 18.75,50.63 18.63,50.75 18.35,50.75 18.23,50.87 18.23,51.61 J8.2
NETJ8_3: length 15.4
  Top Layer w0.127: v1(23.91,50.76) 24.01,50.76 24.13,50.64 24.6,50.64 U1.63 ; 24.08,50.76 23.77,50.45 23.38,50.45 23.26,50.33 23.26,50.25 23.14,50.13 22.9,50.13 22.77,50.25 22.77,50.82 22.65,50.94 22.41,50.94 22.29,50.82 22.29,50.25 22.17,50.13 21.93,50.13 21.81,50.25 21.81,50.82 21.69,50.94 21.45,50.94 21.33,50.82 21.33,50.25 21.21,50.13 20.97,50.13 20.84,50.25 20.84,50.82 20.72,50.94 20.48,50.94 20.36,50.82 20.36,50.25 20.24,50.13 20,50.13 19.88,50.25 19.88,50.82 19.76,50.94 19.52,50.94 19.4,50.82 19.4,50.25 19.28,50.13 19.03,50.13 18.91,50.25 18.91,50.73 18.79,50.86 18.55,50.86 18.43,50.73 18.43,50.57 18.31,50.45 17.47,50.45 17.16,50.77 17.16,51.09 v1(17.12,51.12)
  Bottom Layer w0.127: v1(17.12,51.12) 17.12,51.62
NETJ8_5: length 13.9
  Bottom Layer w0.127: J8.5 14.9,51.63 14.9,52.37 15.39,52.86 16.32,52.86 16.47,52.71 16.47,52.49 16.61,52.34 16.9,52.34 17.05,52.49 17.05,52.99 17.19,53.14 17.49,53.14 17.63,52.99 17.63,52.49 17.78,52.34 18.07,52.34 18.22,52.49 18.22,52.99 18.36,53.14 18.66,53.14 18.8,52.99 18.8,52.49 18.95,52.34 19.24,52.34 19.39,52.49 19.39,52.99 19.53,53.14 19.82,53.14 19.97,52.99 19.97,52.34 20.12,52.19 20.41,52.19 20.55,52.34 20.55,52.71 20.7,52.86 21.09,52.86 R19.2
NETJ8_7: length 15.2
  Top Layer w0.127: U1.62 24.54,49.45 24.32,49.22 v1(22.97,49.22) 19.2,49.22 18.95,49.47 18.7,49.47 18.28,49.04 18.02,49.04 17.58,49.49 17.32,49.49 16.88,49.04 16.63,49.04 16.19,49.49 15.93,49.49 15.49,49.04 15.24,49.04 14.79,49.49 14.54,49.49 14.28,49.22 13.81,49.22 v1(12.89,50.14)
  Bottom Layer w0.127: v1(12.89,50.14) 12.89,50.23 12.72,50.4 J8.7
NETJ8_8: length 15.2
  Top Layer w0.127: v1(23.66,48.43) 24.77,48.43 U1.61 ; v1(12.12,50.37) 12.19,50.3 12.19,49.92 13.66,48.45 23.66,48.45
  Bottom Layer w0.127: 11.62,51.62 11.62,50.86 v1(12.12,50.37)
NETQ1_1: length 1.8
  Top Layer w0.172: R8.2 27.53,16.51 Q1.1
NETQ1_3: length 1.8
  Top Layer w0.172: R9.2 26.46,13.14 Q1.3
NETQ2_1: length 1.5
  Bottom Layer w0.172: Q2.1 9.38,44 9.16,44.21 9.16,44.35 8.96,44.55 R14.2
NETQ2_3: length 1.7
  Bottom Layer w0.172: Q2.3 10.32,41.3 10.54,41.08 10.96,41.08 R15.1
NETQ3_1: length 4.8
  Top Layer w0.172: R16.2 14.88,24.44 12.25,21.81 Q3.1
NETQ4_1: length 1.9
  Top Layer w0.172: R18.2 16.15,21.81 Q4.1
NETR19_1: length 1.3
  Top Layer w0.127: v1(24.03,51.41) 24.75,51.41 U1.64
  Bottom Layer w0.127: 23.53,51.42 24.02,51.42 v1(24.03,51.41)
NETTP1_1: length 1.7
  Top Layer w0.172: 6.69,52.45 7.42,52.45
  Bottom Layer w0.172: v1(7.63,52.45) 7.6,52.49 6.73,52.49 6.69,52.53
NETTP2_1: length 2
  Top Layer w0.172: U1.3 6.85,51.61 v1(7.63,51.61)
  Bottom Layer w0.172: 6.7,51.69 6.76,51.63 7.11,51.63 7.12,51.61 v1(7.63,51.61)
NETTP3_1: length 2
  Top Layer w0.172: U1.4 6.85,50.62 7.41,50.62 7.54,50.75 v1(7.63,50.75)
  Bottom Layer w0.172: 6.69,50.67 6.73,50.71 7.59,50.71 v1(7.63,50.75)
NETTP4_1: length 3.1
  Top Layer w0.254: U1.65 25.54,52.45 26.29,53.2 TP4.1
NETTP5_1: length 1.1
  Top Layer w0.172: U1.32 14.22,27.67 14.29,27.61 TP5.1
NETTP6_1: length 1.1
  Top Layer w0.254: TP6.1 13.23,27.61 13.23,28.69 U1.31
NETTP7_1: length 0.8
  Top Layer w0.381: TP7.1 6.67,43.45
PU_CHIP: length 24.9
  Top Layer w0.172: 6.78,40.55 U1.14 6.74,40.41 7.76,40.41 v1(7.81,40.36) ; Q3.3 12.69,23.76 12.47,23.55 12.03,23.55 10.58,22.1 SW1.1 9.32,22.1 7.72,23.7 7.72,30.03 8.23,30.54 8.23,32.47 v1(8.19,32.51)
  Bottom Layer w0.172: v1(8.19,32.51) 8.19,32.6 7.88,32.91 7.88,35.81 7.91,35.83 7.91,40.18 7.81,40.27 v1(7.81,40.36)
RTS: length 7.2
  Top Layer w0.172: R18.1 13.85,21.55 13.64,21.76 Q3.2 13.64,18.1 12.97,17.42 U3.14
U0RXD: length 54.6
  Top Layer w0.172: U1.13 v1(7.52,41.47) ; v1(5.27,18.69) U3.2
  PWR w0.172: v1(7.52,41.47) 7.79,41.19 19.3,41.19 v1(19.31,41.2)
  Bottom Layer w0.172: v1(5.27,18.69) 4.16,19.81 4.16,31.69 7.19,34.72 7.19,41.14 v1(7.52,41.47) ; J4.6 27.39,36.42 27.39,40.83 26.47,41.75 21,41.75 20.65,41.4 19.58,41.4 19.37,41.2 v1(19.31,41.2)
U0TXD: length 57.3
  Top Layer w0.172: v1(5.93,42.21) 6.02,42.21 6.11,42.3 6.53,42.3 U1.12 ; v1(5.27,17.42) U3.3
  PWR w0.172: v1(20.5,42.19) 14.38,42.19 14.01,42.56 6.27,42.56 v1(5.93,42.21)
  Bottom Layer w0.172: J4.5 28.16,38.2 28.16,41.68 27.39,42.44 20.76,42.44 20.51,42.19 v1(20.5,42.19) ; v1(5.93,42.21) 5.93,40.04 6.49,39.49 6.49,35.1 3.52,32.13 3.52,19.18 v1(5.27,17.42)
USB_N: length 43.4
  Top Layer w0.127: 21.58,6.58 20.93,7.24 20.93,7.96 J1.B7 20.96,8.08 20.96,8.67 21.16,8.87 21.67,8.87 21.81,8.73 21.81,8.08 J1.A7 21.96,8.08 21.96,8.64 21.98,8.66 21.98,8.97 22.4,9.38 23.06,9.38 24.13,10.46 24.13,27.6 24.03,27.71 v1(23.96,27.71) ; U1.54 25.04,41.44 25.23,41.25 25.23,41.17 25.3,41.09 25.93,41.09 26.1,41.27 v1(26.2,41.27)
  Bottom Layer w0.127: v1(23.96,27.71) 23.96,27.8 24.13,27.97 24.13,28.76 23.1,29.79 23.1,32.61 24.22,33.73 24.22,40.18 25.13,41.09 25.94,41.09 26.11,41.27 v1(26.2,41.27) ; 21.58,6.58 21.58,6.26 21.66,6.18 21.81,6.18
  vias: v1(21.58,6.65)
USB_P: length 42.6
  Top Layer w0.127: v1(26.2,40.61) 26.1,40.61 25.93,40.79 25.3,40.79 25.23,40.71 25.23,40.63 25.04,40.44 U1.53 ; 22.31,7.95 22.31,7.33 22.11,7.14 21.66,7.14 21.46,7.33 21.46,7.93 J1.A6 ; v1(24.61,27.71) 24.55,27.71 24.44,27.6 24.44,10.33 23.19,9.08 22.52,9.08 22.29,8.84 22.29,8.66 22.31,8.64 22.31,8.08 J1.B6 22.38,7.49 22.53,7.35 v1(22.53,6.65)
  Bottom Layer w0.127: 22.83,6.18 22.63,6.18 22.55,6.26 22.55,6.62 v1(22.53,6.65) ; v1(24.61,27.71) 24.61,27.8 24.44,27.97 24.44,28.89 23.41,29.92 23.41,32.49 24.52,33.6 24.52,40.05 25.26,40.79 25.94,40.79 26.11,40.61 v1(26.2,40.61)

## Copper pours and planes (outline as drawn; the poured copper is in the pictures)
3V3 on Top Layer: 19.11,15.63 20.54,15.63 20.94,15.23 20.94,14.31 21.24,14 23.06,14 23.34,14.28 23.34,17.64 23.06,17.92 21.51,17.92 20.71,18.72 20.71,19.13 19.11,19.13
3V3 on Bottom Layer: 11.99,39.29 12.23,39.53 12.23,40.77 12.3,40.84 12.66,40.84 12.73,40.77 12.73,39.06 12.79,39 12.79,37.7 11.99,37.7
3V3 on Bottom Layer: 11.99,37.7 12.79,37.7 12.79,39 12.73,39.06 12.73,40.77 12.79,40.83 12.79,41.66 12.35,42.1 11.79,42.1 11.79,41.2 12.23,40.77 12.23,39.24 11.99,39
3V3 on Bottom Layer: 10.53,26.73 11.07,27.27 11.07,27.59 10.95,27.71 9.81,27.71 9.63,27.54 9.63,27.27 10.03,26.87 10.03,25.73 9.35,25.05 8.92,25.05 8.92,23.05 10.53,23.05 10.53,25.73 10.53,25.73
3V3 on PWR: 4.7,59.74 6.04,58.4 6.04,54.71 7,53.75 24.27,53.75 25.88,55.37 25.88,59.16 26.57,59.94 29.65,59.94 30.87,58.72 30.87,6.68 29.86,5.67 27.66,5.67 27,6.32 27,11.05 23.12,14.94 20.9,14.94 18.31,12.34 15.85,12.34 13.72,10.21 1.02,10.21 0.23,11 0.23,58.57 1.4,59.74
5V0 on Top Layer: 17.65,5.79 17.65,3.71 18.73,2.63 19.68,2.63 19.78,2.73 20.91,2.73 24.28,6.11 24.28,8.65 23.78,8.65 23.78,7.47 22.26,5.95 21.25,5.95 19.48,7.72 19.48,8.65 18.98,8.65 18.98,7.12
5V0 on Top Layer: 17.59,10.95 17.19,10.55 17.19,10.14 17.5,9.83 18.36,9.83 18.62,10.09 18.62,10.92 18.27,11.26 18.27,12.54 17.67,12.54 17.59,12.45
5V0 on Top Layer: 11.37,7.29 10.92,6.84 10.92,5.62 10.61,5.29 9.46,5.29 7.07,7.29 7.07,8.59 6.57,8.59 6.57,5.57 9.46,2.67 12.08,2.67 12.41,3.01 12.41,6.8 11.87,7.34 11.87,8.59 11.37,8.59
5V0 on Bottom Layer: 10.93,4.31 12.44,5.82 19.37,5.82 20.22,4.97 20.22,4.43 20.85,3.8 21.03,3.8 21.46,3.37 21.46,2.94 21.17,2.66 18.65,2.66 17.65,3.66 13.09,3.66 12.09,2.66 11.27,2.66 10.93,2.99
5V0 on Bottom Layer: 11.85,4.31 11.94,4.22 11.94,4.06 12.37,3.63 12.37,2.82 12.2,2.66 11.27,2.66 11.01,2.91 9.59,2.91 9.53,2.97 9.53,3.82 10.02,4.31
5V0 on PWR: 13.73,4.95 13.73,3.63 14.06,3.3 16.6,3.3 17.31,4.01 17.31,5.66 16.72,6.26 16.72,7.99 18.58,9.85 18.58,10.33 18.4,10.52 17.09,10.52 14.14,7.56 14.14,6.26 13.73,5.85
GND on Top Layer: 18.91,10.66 18.91,11.2 19.02,11.31 20.85,11.31 21.19,10.98 21.19,10.62 21.11,10.55 19.02,10.55
GND on Top Layer: 4.5,59.94 6.15,58.29 6.15,54.59 7.38,53.37 7.76,53.75 24.27,53.75 25.88,55.37 25.88,59.19 26.64,59.94 28.82,59.94 30.24,59.36 30.82,57.94 30.82,2.51 30.09,0.74 28.31,0 1.75,0 0.51,0.51 0,1.75 0,58.3 0.48,59.46 1.64,59.94
GND on Bottom Layer: 26.64,59.94 25.88,59.19 25.88,55.37 24.26,53.75 7,53.75 6.15,54.59 6.15,58.29 4.5,59.94 1.64,59.94 0.48,59.46 0,58.3 0,1.75 0.51,0.51 1.75,0 28.31,0 30.09,0.74 30.82,2.51 30.82,57.94 30.24,59.36 28.82,59.94
GND on Bottom Layer: 10.92,26.79 10.92,23.05 11.53,23.05 11.53,25.61 12.26,26.34 12.26,27.5 12.17,27.59 11.73,27.59
GND on GND: 4.5,59.94 6.15,58.29 6.15,54.59 7,53.75 24.27,53.75 25.88,55.37 25.88,59.19 26.64,59.94 28.82,59.94 30.24,59.36 30.82,57.94 30.82,2.51 30.09,0.74 28.31,0 1.75,0 0.51,0.51 0,1.75 0,58.3 0.48,59.46 1.64,59.94
NETL2_1 on Top Layer: 17.67,14.11 18.27,14.11 18.27,14.91 17.91,15.27 17.91,19.13 16.31,19.13 16.31,14.19 16.51,13.99 17.56,13.99

Small or netless copper shapes (teardrops, artwork), in the pictures only: 161 on Top Layer, 91 on Bottom Layer, 10 on PWR

## Text on the board
Bottom Silkscreen Layer: www.vicharak.in | Designed By | VICHARAK
